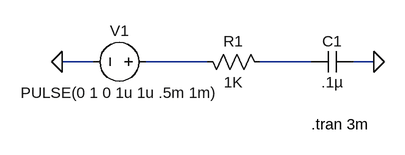
[diagram p0: schematic PosCurrentDirection.asc]
PosCurrentDirection.asc, the LTspice schematic file:
Version 4
SHEET 1 2720 1336
WIRE 1424 768 1376 768
WIRE 1600 768 1504 768
WIRE 1760 768 1680 768
WIRE 1856 768 1824 768
FLAG 1376 768 0
FLAG 1856 768 0
SYMBOL VOLTAGE 1520 768 R90
WINDOW 0 -32 56 VBottom 0
WINDOW 3 32 56 VTop 0
SYMATTR InstName V1
SYMATTR Value PULSE(0 1 0 1u 1u .5m 1m)
SYMATTR SpiceLine RSER=.01
SYMBOL res 1584 752 M90
WINDOW 0 0 56 VBottom 0
WINDOW 3 32 56 VTop 0
SYMATTR InstName R1
SYMATTR Value 1K
SYMBOL cap 1824 752 R90
WINDOW 0 0 32 VBottom 0
WINDOW 3 32 32 VTop 0
SYMATTR InstName C1
SYMATTR Value .1µ
TEXT 1760 864 Left 0 !.tran 3m

The netlist it stands for:
* PosCurrentDirection.asc
V1 N001 0 PULSE(0 1 0 1u 1u .5m 1m) RSER=.01
R1 N001 N002 1K
C1 0 N002 .1µ
.tran 3m
.backanno
.end